# EAGLE design test_filter (EAGLE 6.1)
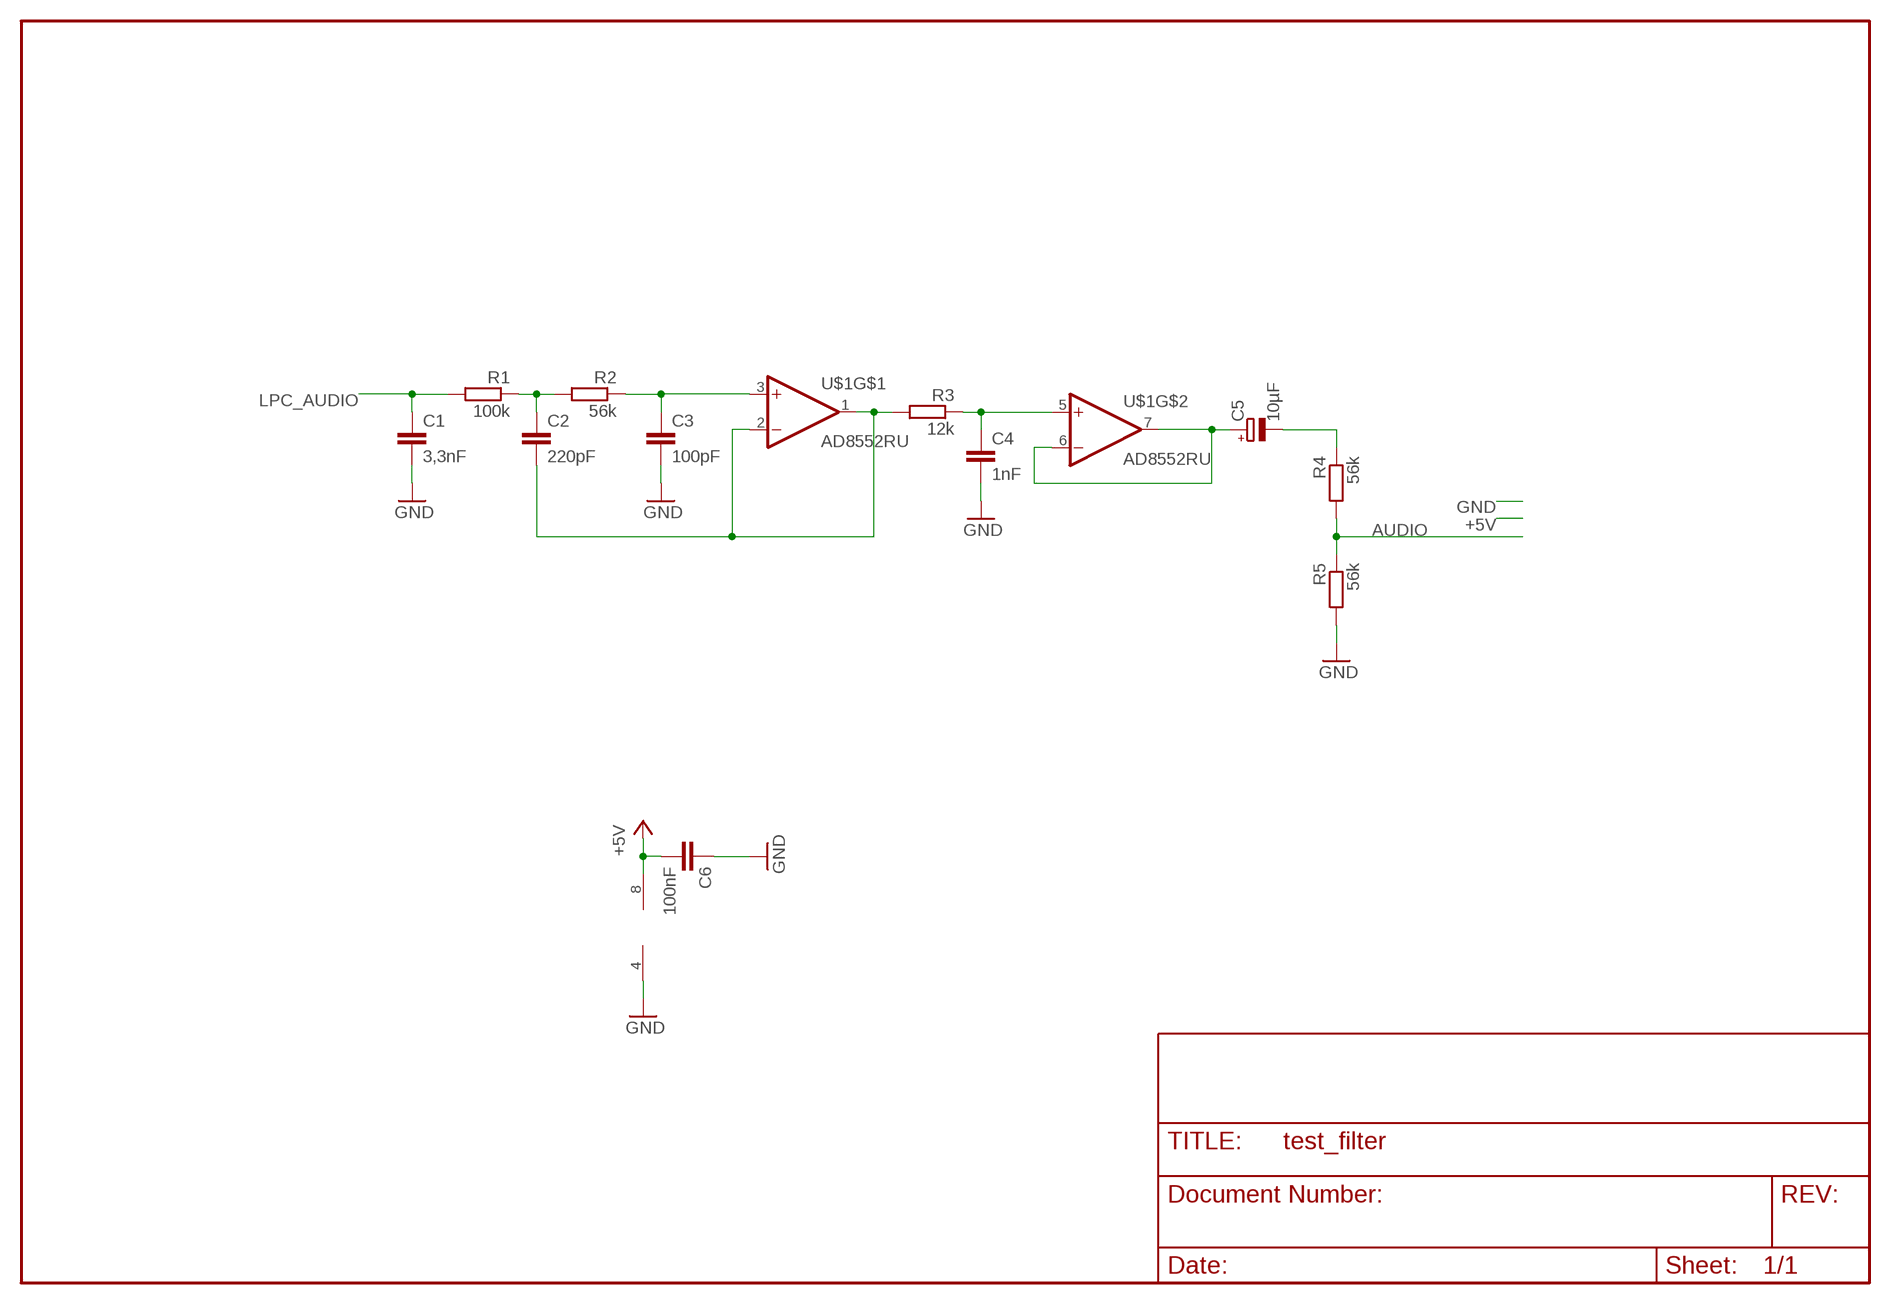
[diagram p0: schematic, sheet 1]

## Parts
C1  3,3nF  C-EU050-030X075  [C050-030X075]
C2  220pF  C-EU050-030X075  [C050-030X075]
C3  100pF  C-EU050-030X075  [C050-030X075]
C4  1nF  C-EU050-030X075  [C050-030X075]
C5  10µF  CPOL-EUE2.5-7  [E2,5-7]
C6  100nF  C-EU050-030X075  [C050-030X075]
R1  100k  R-EU_0204/7  [0204/7]
R2  56k  R-EU_0204/7  [0204/7]
R3  12k  R-EU_0204/7  [0204/7]
R4  56k  R-EU_0204/7  [0204/7]
R5  56k  R-EU_0204/7  [0204/7]
U$1  AD8552RU  [TSSOP8]

## Nets
+5V: C6.2 U$1.8(V+)
AUDIO: R4.2 R5.1
GND: C1.2 C3.2 C4.2 C6.1 R5.2 U$1.4(V-)
LPC_AUDIO: C1.1 R1.2
N$14: C5.+ U$1.6(-IN) U$1.7(OUT)
N$15: C2.2 R3.2 U$1.1(OUT) U$1.2(-IN)
N$16: C2.1 R1.1 R2.2
N$17: C3.1 R2.1 U$1.3(+IN)
N$18: C5.- R4.1
N$19: C4.1 R3.1 U$1.5(+IN)

## Library data of the parts
C1-C4 C6 = rcl:C-EU: CAPACITOR, European symbol
C5 = rcl:CPOL-EU: POLARIZED CAPACITOR, European symbol
R1-R5 = rcl:R-EU_: RESISTOR, European symbol
U$1 = paparazzi:AD8552: dual op amp

## Board
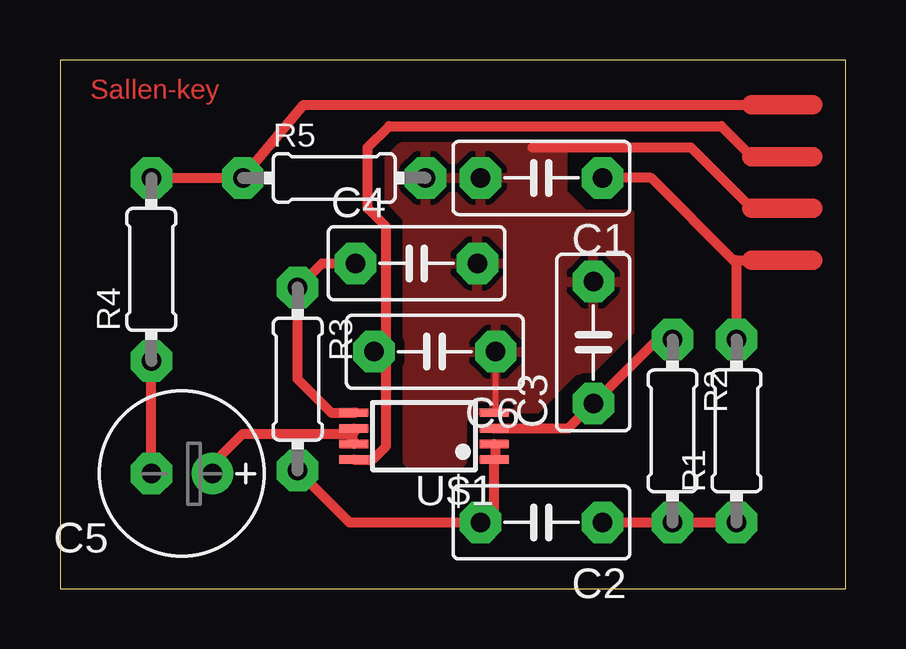
[diagram p1: board, top side]

Size 32.75 x 22.02 mm. Coordinates in mm from the lower left corner, seen from the top.
Outline: 0,0 32.75,0 32.75,22.02 0,22.02 0,0
Copper layers (1*16): Top 0.035mm / dielectric 1.5mm / Bottom 0.035mm
Design rules: minimum track width 10mil, minimum drill 24mil, track to track 8mil, track to pad 8mil, pad to pad 8mil, via to via 8mil, smd to smd 8mil, copper to edge 40mil, drill to drill 8mil, minimum pad ring 18mil, minimum via ring 8mil, stop-mask expansion 4mil, vias tented up to drill 0mil, thermal gap 10mil

### Footprints (pad centres in the part's own frame; a part is rotated, then mirrored left to right if it is on the bottom)
C050-030X075 = drill 0.813 octagon: 1 -2.54,0; 2 2.54,0
E2,5-7 = drill 0.813 pad 1.6: + -1.27,0 | drill 0.813 pad 1.6 octagon: - 1.27,0
0204/7 = drill 0.813 octagon: 1 -3.81,0; 2 3.81,0
TSSOP8 = smd 0.35 x 1.2: 1 -0.975,-2.925; 2 -0.325,-2.925; 3 0.325,-2.925; 4 0.975,-2.925; 5 0.975,2.925; 6 0.325,2.925; 7 -0.325,2.925; 8 -0.975,2.925

### Placement (x,y rotation side)
C1  20.06,17.11 180 top
C2  20.06,2.76 180 top
C3  22.22,10.25 90 top
C4  14.85,13.55 0 top
C5  5.08,4.79 180 top
C6  15.62,9.87 180 top
R1  28.19,6.57 90 top
R2  25.52,6.57 270 top
R3  9.9,8.73 270 top
R4  3.81,13.3 90 top
R5  11.42,17.11 0 top
U$1  15.17,6.35 90 top

### Tracks (layer width: path | path; a pad name or v marks a point on that pad's centre or on a via)
+5V
  Top 0.406: 28.82,18 27.55,19.27 13.71,19.27 12.82,18.38 12.82,15.84 13.58,15.07 13.58,9.87 | U$1.8 13.03,5.37 13.58,5.93 13.58,9.23 13.58,9.87 | 13.58,9.87 C6.2
  Top 0.813: 28.82,18 31.36,18
AUDIO
  Top 0.406: R4.2 R5.1 10.15,20.15 28.82,20.15
  Top 0.813: 28.82,20.15 31.36,20.15
GND
  Top 0.254: U$1.4 18.15,7.32 18.16,7.33 C6.1
  Top 0.406: 19.68,18.38 26.28,18.38 28.82,15.84
  Top 0.813: 28.82,15.84 31.36,15.84
  pour Top (isolate 0.406): 14.22,18.38 13.71,17.87 13.71,16.22 14.47,15.46 14.47,5.3 14.6,5.17 16.63,5.17 16.76,5.3 16.76,7.07 17.01,7.33 19.68,7.33 21.46,9.11 22.09,9.11 23.74,10.76 23.74,15.58 21.84,15.58 20.95,16.47 20.95,18.38
LPC_AUDIO
  Top 0.406: C1.1 24.63,17.11 28.06,13.68 28.19,13.68 | 28.19,13.68 28.82,13.68 | R1.2 28.19,13.68
  Top 0.813: 28.82,13.68 31.36,13.68
N$14
  Top 0.406: C5.+ 6.35,5.17 7.62,6.44 12.19,6.44 | 12.19,6.44 12.24,6.49 U$1.6 | U$1.7 12.24,6.13 12.19,6.19 12.19,6.44
N$15
  Top 0.406: U$1.2 18.16,5.96 18.16,5.42 18.14,5.42 U$1.1 18.09,3.33 C2.2 12.06,2.76 R3.2
N$16
  Top 0.406: C2.1 R2.2 R1.1
N$17
  Top 0.406: U$1.3 21.18,6.67 C3.1 24.89,10.38 R2.1
N$18
  Top 0.406: 3.81,9.61 R4.1 C5.-
N$19
  Top 0.406: U$1.5 12.31,7.32 12.31,7.33 11.3,7.33 9.9,8.73 R3.1 10.92,13.55 C4.1

### Text on the board
Top: Sallen-key